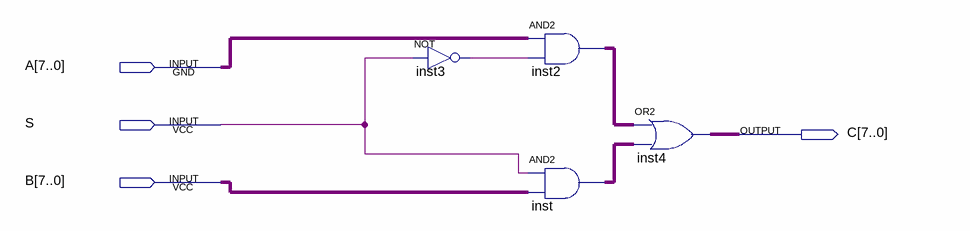
[diagram p0: schematic sheet]
// Quartus schematic MUX8.bdf as structural Verilog: 4 symbols, 4 pins
module MUX8 (
  input  [7:0] A,
  input  S,
  input  [7:0] B,
  output [7:0] C
);

  wire inst3_out;
  wire [7:0] inst2_out, inst_out;

  not inst3 (inst3_out, S);
  assign inst2_out = A & {8{inst3_out}};  // AND2 inst2, 8 bits wide
  assign inst_out = {8{S}} & B;  // AND2 inst, 8 bits wide
  assign C = inst2_out | inst_out;  // OR2 inst4, 8 bits wide
endmodule
